# EAGLE schematic PCB ALIMENTACION (EAGLE 7.3.0)
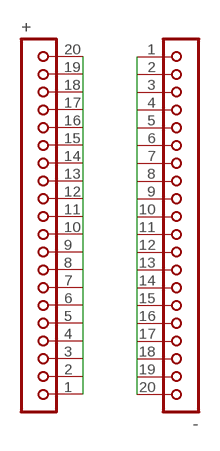
[diagram p0: schematic, sheet 1]

## Parts
+  JBK20  [JBK20]
-  JBK20  [JBK20]

## Nets
N$1: +.1 +.20
N$2: -.1 -.20
Unconnected: +.2 +.3 +.4 +.5 +.6 +.7 +.8 +.9 +.10 +.11 +.12 +.13 +.14 +.15 +.16 +.17 +.18 +.19 -.2 -.3 -.4 -.5 -.6 -.7 -.8 -.9 -.10 -.11 -.12 -.13 -.14 -.15 -.16 -.17 -.18 -.19

## Library data of the parts
+ - = con-lsta:JBK20: PIN HEADER; OC_FARNELL: unknown; OC_NEWARK: unknown